# EAGLE design IrLedJig (EAGLE 7.5.0)
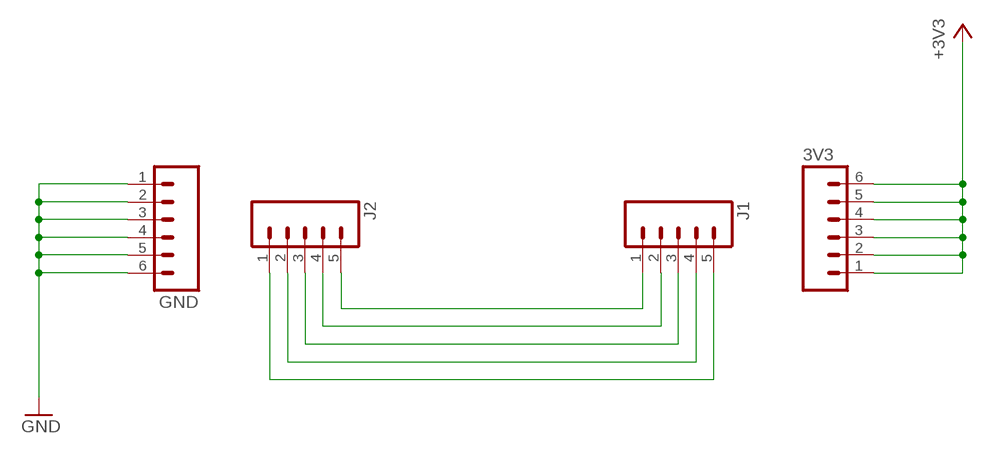
[diagram p0: schematic, sheet 1]

## Parts
3V3  M06LOCK  [1X06_LOCK]
GND  M06LOCK  [1X06_LOCK]
J1  M05LOCK  [1X05_LOCK]
J2  M05LOCK  [1X05_LOCK]

## Nets
+3V3 [GND]: 3V3.1 3V3.2 3V3.3 3V3.4 3V3.5 3V3.6
GND [GND]: GND.1 GND.2 GND.3 GND.4 GND.5 GND.6
N$3 [JUMPER]: J1.1 J2.5
N$4 [JUMPER]: J1.2 J2.4
N$5 [JUMPER]: J1.3 J2.3
N$6 [JUMPER]: J1.4 J2.2
N$7 [JUMPER]: J1.5 J2.1

## Library data of the parts
3V3 GND = SparkFun:M06: Header 6 Standard 6-pin 0.1" header. Use with straight break away headers (SKU : PRT-00116), right angle break away headers (PRT-00553), swiss pins (PRT-00743), machine pins (PRT-00117), and female headers (PRT-00115). Molex polarized connector foot print use with SKU : PRT-08094 with associated crimp pins and housings. NOTES ON THE VARIANTS LOCK and LOCK_LONGPADS... This footprint was designed to help hold the alignment of a through-hole component (i.e. 6-pin header) while soldering it into place. You may notice that each hole has been shifted either up or down by 0.005 of an inch from it's more standard position (which is a perfectly straight line). This slight alteration caused the pins (the squares in the middle) to touch the edges of the holes. Because they are alternating, it causes a "brace" to hold the component in place. 0.005 has proven to be the perfect amount of "off-center" position when using our standard breakaway headers. Although looks a little odd when you look at the bare footprint, once you have a header in there, the alteration is very hard to notice. Also, if you push a header all the way into place, it is covered up entirely on the bottom side. This idea of altering the position of holes to aid alignment will be further integrated into the Sparkfun Library for other footprints. It can help hold any component with 3 or more connection pins.
J1 J2 = SparkFun:M05: Header 5 Standard 5-pin 0.1" header. Use with straight break away headers (SKU : PRT-00116), right angle break away headers (PRT-00553), swiss pins (PRT-00743), machine pins (PRT-00117), and female headers (PRT-00115). Molex polarized connector foot print use with SKU : PRT-08230 with associated crimp pins and housings.

## Net classes
1 GND: width 0.5 mm, drill 0.5 mm, clearance 0.5 mm
2 3v3: width 0.5 mm, drill 0.5 mm, clearance 0.5 mm
3 JUMPER: width 0.5 mm, drill 0.5 mm, clearance 0.5 mm

## Board
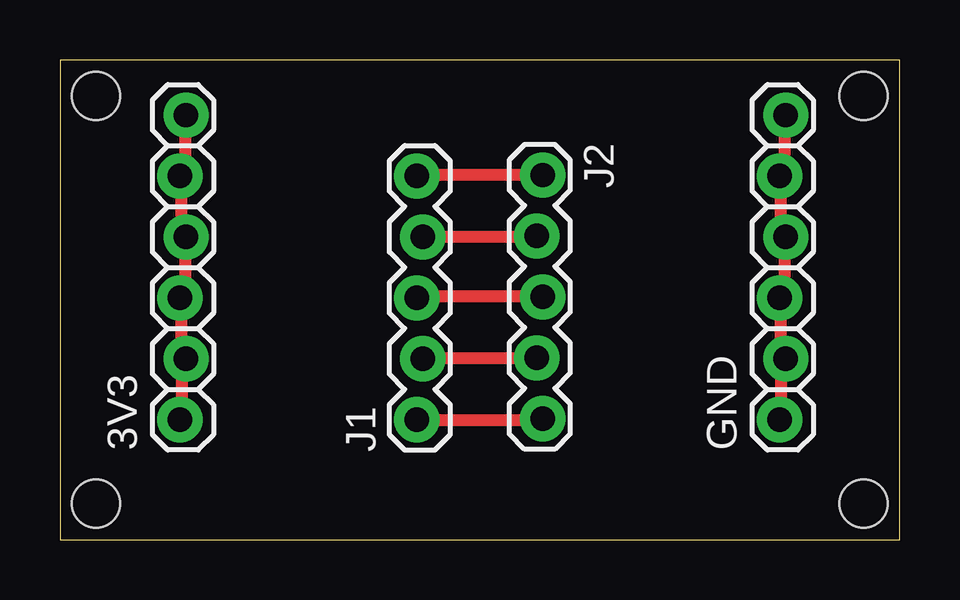
[diagram p1: board, top side]

Size 35 x 20 mm. Coordinates in mm from the lower left corner, seen from the top.
Outline: 0,0 35,0 35,20 0,20 0,0
Copper layers (1*16): Top 0.0356mm / dielectric 1.5011mm / Bottom 0.0356mm
Design rules "Codeshelf_Standard": minimum track width 7mil, minimum drill 14mil, track to track 7mil, track to pad 7mil, pad to pad 7mil, via to via 7mil, smd to smd 0mil, copper to edge 20mil, drill to drill 8mil, minimum pad ring 10mil, minimum via ring 8mil, stop-mask expansion 4mil, vias tented up to drill 0mil, thermal gap 10mil
Holes 2 mm at 1.5,1.5 1.5,18.5 33.5,18.5 33.5,1.5

### Footprints (pad centres in the part's own frame; a part is rotated, then mirrored left to right if it is on the bottom)
1X06_LOCK = drill 1.016 pad 1.88: 1 0,0; 2 2.54,-0.254; 3 5.08,0; 4 7.62,-0.254; 5 10.16,0; 6 12.7,-0.254
1X05_LOCK = drill 1.016 pad 1.88: 1 0,0.127; 2 2.54,-0.127; 3 5.08,0.127; 4 7.62,-0.127; 5 10.16,0.127

### Placement (x,y rotation side)
3V3  5,5 90 top
GND  30,5 90 top
J1  15,5 90 top
J2  20,15.2 270 top

### Tracks (layer width: path | path; a pad name or v marks a point on that pad's centre or on a via)
+3V3
  Top 0.5: 3V3.1 5.07,5.07 5.07,7.29 5.25,7.47 3V3.2 5.07,7.64 5.07,10.05 3V3.3 5.25,10.22 5.25,12.54 3V3.4 5.07,12.71 5.07,15.11 3V3.5 5.25,15.29 3V3.6
GND
  Top 0.5: GND.1 30.05,5.07 30.05,7.29 30.23,7.47 GND.2 30.05,7.64 30.05,10.05 GND.3 30.23,10.22 30.23,12.54 GND.4 30.05,12.71 30.05,15.11 GND.5 30.05,15.38 30.23,15.56 30.23,17.69 GND.6
N$3
  Top 0.5: J1.1 14.94,4.98 20.09,4.98 J2.5
N$4
  Top 0.5: J1.2 15.2,7.56 19.82,7.56 J2.4
N$5
  Top 0.5: J1.3 14.94,10.13 20.09,10.13 J2.3
N$6
  Top 0.5: J1.4 15.2,12.62 19.82,12.62 J2.2
N$7
  Top 0.5: J1.5 14.94,15.2 20.09,15.2 J2.1